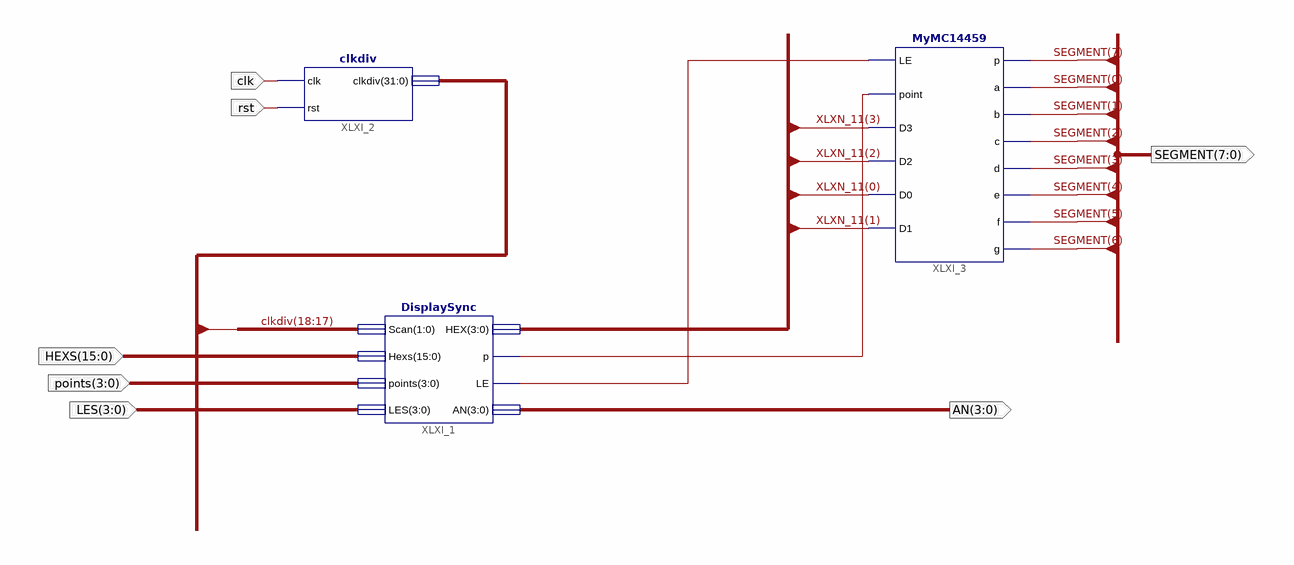
[diagram p0: schematic sheet 1]
// Xilinx ISE schematic disp_num.sch (artix7) as structural Verilog: 3 symbols, 7 ports
module disp_num (
  input  clk,
  input  rst,
  input  [15:0] HEXS,
  input  [3:0] points,
  input  [3:0] LES,
  output [3:0] AN,
  output [7:0] SEGMENT
);

  wire XLXN_8, XLXN_9;
  wire [3:0] XLXN_11;
  wire [31:0] clkdiv;

  DisplaySync XLXI_1 (
    .Scan(clkdiv[18:17]), .Hexs(HEXS), .points(points), .LES(LES), .HEX(XLXN_11), .p(XLXN_8), .LE(XLXN_9),
    .AN(AN));
  clkdiv XLXI_2 (.clk(clk), .rst(rst), .clkdiv(clkdiv));
  MyMC14459 XLXI_3 (
    .LE(XLXN_9), .point(XLXN_8), .D3(XLXN_11[3]), .D2(XLXN_11[2]), .D0(XLXN_11[0]), .D1(XLXN_11[1]),
    .p(SEGMENT[7]), .a(SEGMENT[0]), .b(SEGMENT[1]), .c(SEGMENT[2]), .d(SEGMENT[3]), .e(SEGMENT[4]),
    .f(SEGMENT[5]), .g(SEGMENT[6]));
endmodule
